# Altium schematic sheet 0191_GPP_A_B_F_G_H.SchDoc
size A2
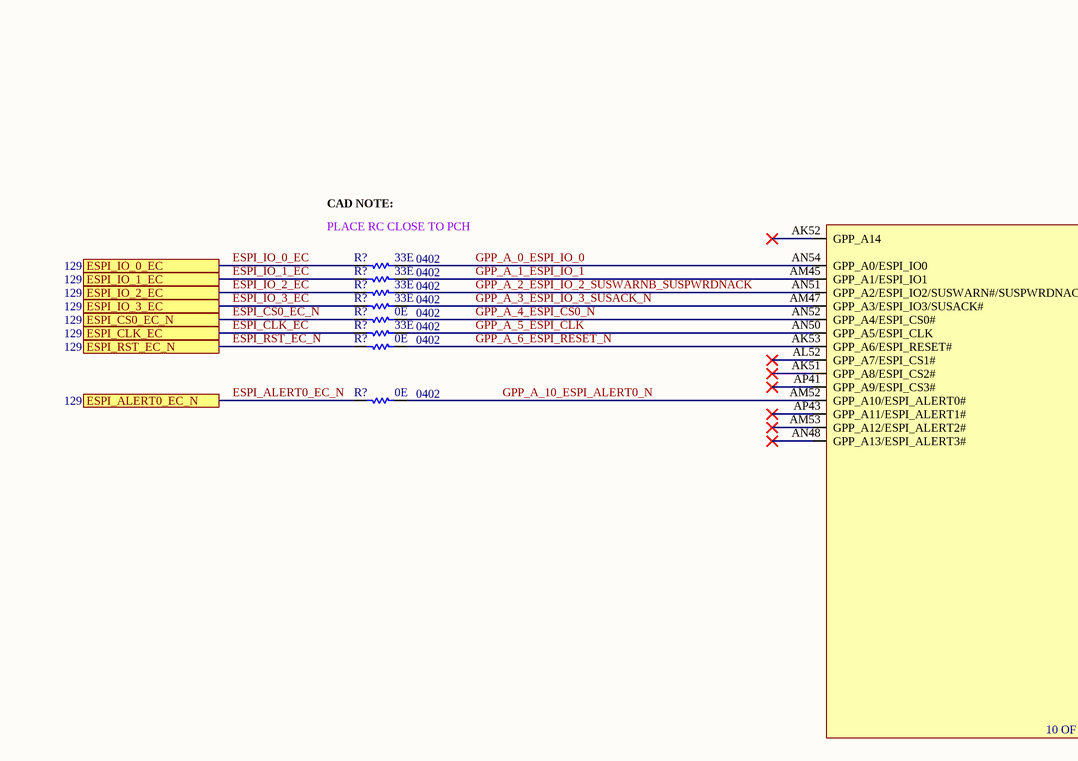
[diagram p0: 0191_GPP_A_B_F_G_H.SchDoc, top left]
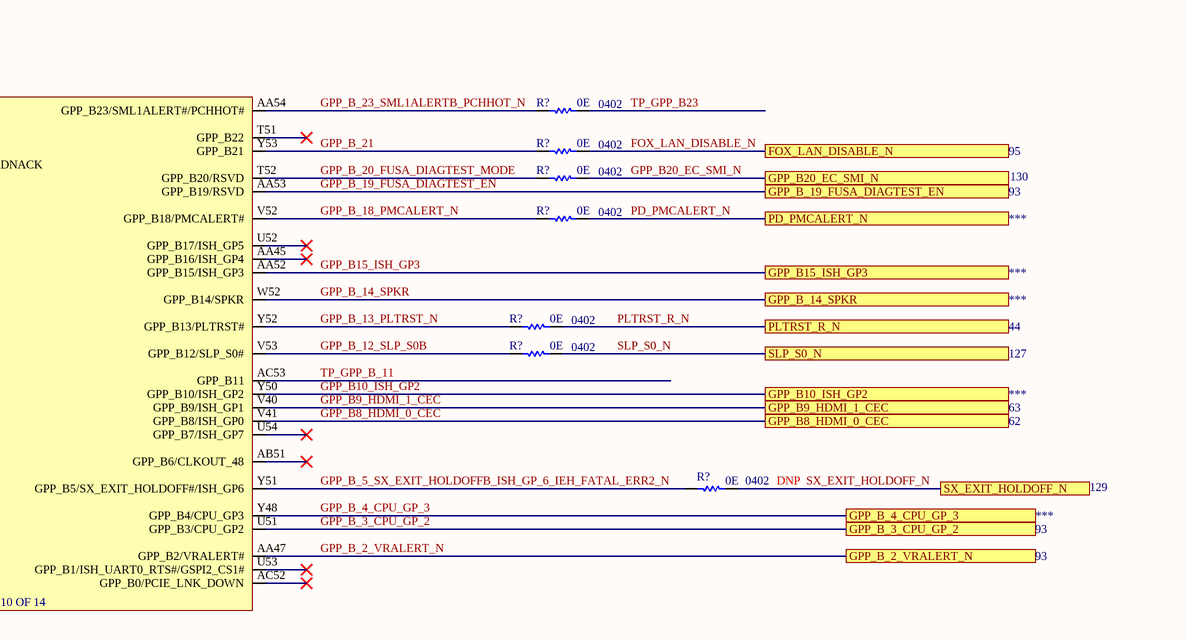
[diagram p1: 0191_GPP_A_B_F_G_H.SchDoc, top middle]
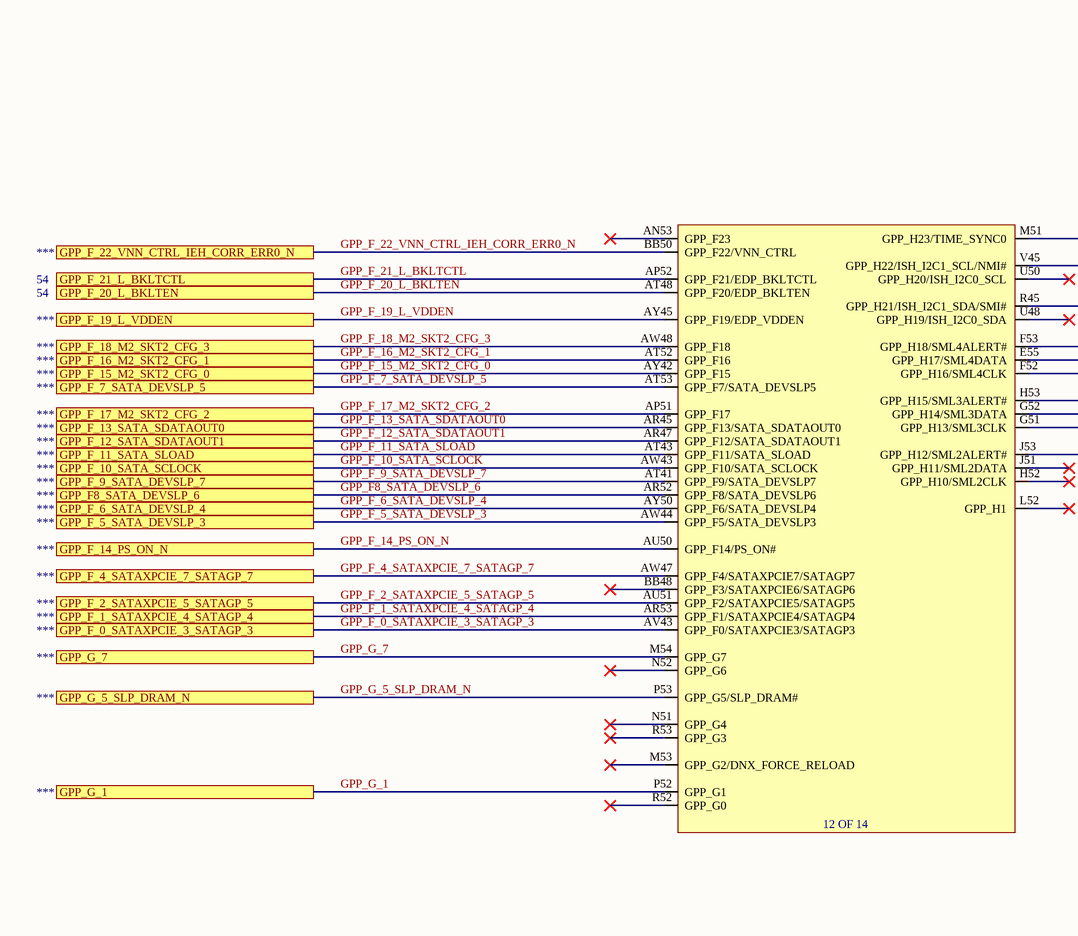
[diagram p2: 0191_GPP_A_B_F_G_H.SchDoc, bottom left]
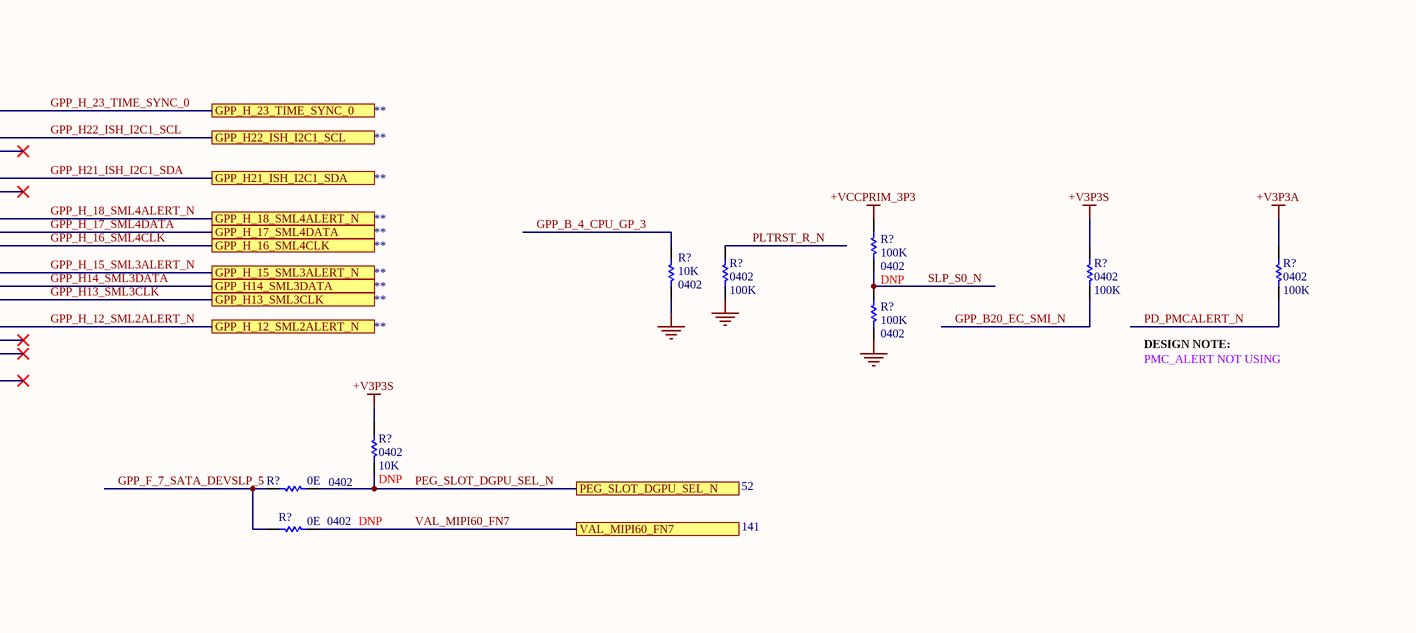
[diagram p3: 0191_GPP_A_B_F_G_H.SchDoc, bottom middle]

## Parts
(Parts that share a designator on the sheet are numbered #1, #2 ... from top to bottom, then left to right.)
R?#1  value 0E  Case/Package: 0402  [RESC0402]  (hidden comment: Res)
R?#2  value 33E  Case/Package: 0402  [RESC0402]  (hidden comment: Res)
R?#3  value 33E  Case/Package: 0402  [RESC0402]  (hidden comment: Res)
R?#4  value 0E  Case/Package: 0402  [RESC0402]  (hidden comment: Res)
R?#5  value 33E  Case/Package: 0402  [RESC0402]  (hidden comment: Res)
R?#6  value 33E  Case/Package: 0402  [RESC0402]  (hidden comment: Res)
R?#7  value 0E  Case/Package: 0402  [RESC0402]  (hidden comment: Res)
R?#8  value 0E  Case/Package: 0402  [RESC0402]  (hidden comment: Res)
R?#9  value 33E  Case/Package: 0402  [RESC0402]  (hidden comment: Res)
R?#10  value 0E  Case/Package: 0402  [RESC0402]  (hidden comment: Res)
R?#11  value 0E  Case/Package: 0402  [RESC0402]  (hidden comment: Res)
R?#12  value 0E  Case/Package: 0402  [RESC0402]  (hidden comment: Res)
R?#13  value 0E  Case/Package: 0402  [RESC0402]  (hidden comment: Res)
R?#14  value 0E  Case/Package: 0402  [RESC0402]  (hidden comment: Res)
R?#15  value 0E  Case/Package: 0402  [RESC0402]  (hidden comment: Res)
R?#16  value 100K  Case/Package: 0402  [RESC0402]  (hidden comment: Res)
R?#17  value 10K  Case/Package: 0402  [RESC0402]  (hidden comment: Res)
R?#18  value 100K  Case/Package: 0402  [RESC0402]  (hidden comment: Res)
R?#19  value 100K  Case/Package: 0402  [RESC0402]  (hidden comment: Res)
R?#20  value 100K  Case/Package: 0402  [RESC0402]  (hidden comment: Res)
R?#21  value 100K  Case/Package: 0402  [RESC0402]  (hidden comment: Res)
R?#22  value 10K  Case/Package: 0402  [RESC0402]  (hidden comment: Res)
R?#23  value 0E  Case/Package: 0402  [RESC0402]  (hidden comment: Res)
R?#24  value 0E  Case/Package: 0402  [RESC0402]  (hidden comment: Res)
U23601  C_RPL_S_PCH_EXT  (value not drawn)  (parts J,L of 14)

## Ports
ESPI_ALERT0_EC_N, ESPI_CLK_EC, ESPI_CS0_EC_N, ESPI_IO_0_EC, ESPI_IO_1_EC, ESPI_IO_2_EC, ESPI_IO_3_EC, ESPI_RST_EC_N, FOX_LAN_DISABLE_N, GPP_B8_HDMI_0_CEC, GPP_B9_HDMI_1_CEC, GPP_B10_ISH_GP2, GPP_B15_ISH_GP3, GPP_B20_EC_SMI_N, GPP_B_2_VRALERT_N, GPP_B_3_CPU_GP_2, GPP_B_4_CPU_GP_3, GPP_B_14_SPKR, GPP_B_19_FUSA_DIAGTEST_EN, GPP_F8_SATA_DEVSLP_6, GPP_F_0_SATAXPCIE_3_SATAGP_3, GPP_F_1_SATAXPCIE_4_SATAGP_4, GPP_F_2_SATAXPCIE_5_SATAGP_5, GPP_F_4_SATAXPCIE_7_SATAGP_7, GPP_F_5_SATA_DEVSLP_3, GPP_F_6_SATA_DEVSLP_4, GPP_F_7_SATA_DEVSLP_5, GPP_F_9_SATA_DEVSLP_7, GPP_F_10_SATA_SCLOCK, GPP_F_11_SATA_SLOAD, GPP_F_12_SATA_SDATAOUT1, GPP_F_13_SATA_SDATAOUT0, GPP_F_14_PS_ON_N, GPP_F_15_M2_SKT2_CFG_0, GPP_F_16_M2_SKT2_CFG_1, GPP_F_17_M2_SKT2_CFG_2, GPP_F_18_M2_SKT2_CFG_3, GPP_F_19_L_VDDEN, GPP_F_20_L_BKLTEN, GPP_F_21_L_BKLTCTL, GPP_F_22_VNN_CTRL_IEH_CORR_ERR0_N, GPP_G_1, GPP_G_5_SLP_DRAM_N, GPP_G_7, GPP_H13_SML3CLK, GPP_H14_SML3DATA, GPP_H21_ISH_I2C1_SDA, GPP_H22_ISH_I2C1_SCL, GPP_H_12_SML2ALERT_N, GPP_H_15_SML3ALERT_N, GPP_H_16_SML4CLK, GPP_H_17_SML4DATA, GPP_H_18_SML4ALERT_N, GPP_H_23_TIME_SYNC_0, PD_PMCALERT_N, PEG_SLOT_DGPU_SEL_N, PLTRST_R_N, SLP_S0_N, SX_EXIT_HOLDOFF_N, VAL_MIPI60_FN7

## Nets
+V3P3A: R?#20.1
+V3P3S: R?#19.1 R?#22.2
+VCCPRIM_3P3: R?#16.2
GND: R?#17.1 R?#18.1 R?#21.1
ESPI_ALERT0_EC_N: R?#12.1 ; port ESPI_ALERT0_EC_N
ESPI_CLK_EC: R?#9.1 ; port ESPI_CLK_EC
ESPI_CS0_EC_N: R?#8.1 ; port ESPI_CS0_EC_N
ESPI_IO_0_EC: R?#2.1 ; port ESPI_IO_0_EC
ESPI_IO_1_EC: R?#3.1 ; port ESPI_IO_1_EC
ESPI_IO_2_EC: R?#5.1 ; port ESPI_IO_2_EC
ESPI_IO_3_EC: R?#6.1 ; port ESPI_IO_3_EC
ESPI_RST_EC_N: R?#10.1 ; port ESPI_RST_EC_N
FOX_LAN_DISABLE_N: R?#4.2 ; port FOX_LAN_DISABLE_N
GPP_A_0_ESPI_IO_0: R?#2.2 U23601.AN54(GPP_A0/ESPI_IO0)
GPP_A_1_ESPI_IO_1: R?#3.2 U23601.AM45(GPP_A1/ESPI_IO1)
GPP_A_2_ESPI_IO_2_SUSWARNB_SUSPWRDNACK: R?#5.2 U23601.AN51(GPP_A2/ESPI_IO2/SUSWARN#/SUSPWRDNACK)
GPP_A_3_ESPI_IO_3_SUSACK_N: R?#6.2 U23601.AM47(GPP_A3/ESPI_IO3/SUSACK#)
GPP_A_4_ESPI_CS0_N: R?#8.2 U23601.AN52(GPP_A4/ESPI_CS0#)
GPP_A_5_ESPI_CLK: R?#9.2 U23601.AN50(GPP_A5/ESPI_CLK)
GPP_A_6_ESPI_RESET_N: R?#10.2 U23601.AK53(GPP_A6/ESPI_RESET#)
GPP_A_10_ESPI_ALERT0_N: R?#12.2 U23601.AM52(GPP_A10/ESPI_ALERT0#)
GPP_B8_HDMI_0_CEC: U23601.V41(GPP_B8/ISH_GP0) ; port GPP_B8_HDMI_0_CEC
GPP_B9_HDMI_1_CEC: U23601.V40(GPP_B9/ISH_GP1) ; port GPP_B9_HDMI_1_CEC
GPP_B10_ISH_GP2: U23601.Y50(GPP_B10/ISH_GP2) ; port GPP_B10_ISH_GP2
GPP_B15_ISH_GP3: U23601.AA52(GPP_B15/ISH_GP3) ; port GPP_B15_ISH_GP3
GPP_B20_EC_SMI_N: R?#7.2 R?#19.2 ; port GPP_B20_EC_SMI_N
GPP_B_2_VRALERT_N: U23601.AA47(GPP_B2/VRALERT#) ; port GPP_B_2_VRALERT_N
GPP_B_3_CPU_GP_2: U23601.U51(GPP_B3/CPU_GP2) ; port GPP_B_3_CPU_GP_2
GPP_B_4_CPU_GP_3: R?#17.2 U23601.Y48(GPP_B4/CPU_GP3) ; port GPP_B_4_CPU_GP_3
GPP_B_5_SX_EXIT_HOLDOFFB_ISH_GP_6_IEH_FATAL_ERR2_N: R?#15.1 U23601.Y51(GPP_B5/SX_EXIT_HOLDOFF#/ISH_GP6)
GPP_B_12_SLP_S0B: R?#14.1 U23601.V53(GPP_B12/SLP_S0#)
GPP_B_13_PLTRST_N: R?#13.1 U23601.Y52(GPP_B13/PLTRST#)
GPP_B_14_SPKR: U23601.W52(GPP_B14/SPKR) ; port GPP_B_14_SPKR
GPP_B_18_PMCALERT_N: R?#11.1 U23601.V52(GPP_B18/PMCALERT#)
GPP_B_19_FUSA_DIAGTEST_EN: U23601.AA53(GPP_B19/RSVD) ; port GPP_B_19_FUSA_DIAGTEST_EN
GPP_B_20_FUSA_DIAGTEST_MODE: R?#7.1 U23601.T52(GPP_B20/RSVD)
GPP_B_21: R?#4.1 U23601.Y53(GPP_B21)
GPP_B_23_SML1ALERTB_PCHHOT_N: R?#1.1 U23601.AA54(GPP_B23/SML1ALERT#/PCHHOT#)
GPP_F8_SATA_DEVSLP_6: U23601.AR52(GPP_F8/SATA_DEVSLP6) ; port GPP_F8_SATA_DEVSLP_6
GPP_F_0_SATAXPCIE_3_SATAGP_3: U23601.AV43(GPP_F0/SATAXPCIE3/SATAGP3) ; port GPP_F_0_SATAXPCIE_3_SATAGP_3
GPP_F_1_SATAXPCIE_4_SATAGP_4: U23601.AR53(GPP_F1/SATAXPCIE4/SATAGP4) ; port GPP_F_1_SATAXPCIE_4_SATAGP_4
GPP_F_2_SATAXPCIE_5_SATAGP_5: U23601.AU51(GPP_F2/SATAXPCIE5/SATAGP5) ; port GPP_F_2_SATAXPCIE_5_SATAGP_5
GPP_F_4_SATAXPCIE_7_SATAGP_7: U23601.AW47(GPP_F4/SATAXPCIE7/SATAGP7) ; port GPP_F_4_SATAXPCIE_7_SATAGP_7
GPP_F_5_SATA_DEVSLP_3: U23601.AW44(GPP_F5/SATA_DEVSLP3) ; port GPP_F_5_SATA_DEVSLP_3
GPP_F_6_SATA_DEVSLP_4: U23601.AY50(GPP_F6/SATA_DEVSLP4) ; port GPP_F_6_SATA_DEVSLP_4
GPP_F_7_SATA_DEVSLP_5: R?#23.1 R?#24.1 U23601.AT53(GPP_F7/SATA_DEVSLP5) ; port GPP_F_7_SATA_DEVSLP_5
GPP_F_9_SATA_DEVSLP_7: U23601.AT41(GPP_F9/SATA_DEVSLP7) ; port GPP_F_9_SATA_DEVSLP_7
GPP_F_10_SATA_SCLOCK: U23601.AW43(GPP_F10/SATA_SCLOCK) ; port GPP_F_10_SATA_SCLOCK
GPP_F_11_SATA_SLOAD: U23601.AT43(GPP_F11/SATA_SLOAD) ; port GPP_F_11_SATA_SLOAD
GPP_F_12_SATA_SDATAOUT1: U23601.AR47(GPP_F12/SATA_SDATAOUT1) ; port GPP_F_12_SATA_SDATAOUT1
GPP_F_13_SATA_SDATAOUT0: U23601.AR45(GPP_F13/SATA_SDATAOUT0) ; port GPP_F_13_SATA_SDATAOUT0
GPP_F_14_PS_ON_N: U23601.AU50(GPP_F14/PS_ON#) ; port GPP_F_14_PS_ON_N
GPP_F_15_M2_SKT2_CFG_0: U23601.AY42(GPP_F15) ; port GPP_F_15_M2_SKT2_CFG_0
GPP_F_16_M2_SKT2_CFG_1: U23601.AT52(GPP_F16) ; port GPP_F_16_M2_SKT2_CFG_1
GPP_F_17_M2_SKT2_CFG_2: U23601.AP51(GPP_F17) ; port GPP_F_17_M2_SKT2_CFG_2
GPP_F_18_M2_SKT2_CFG_3: U23601.AW48(GPP_F18) ; port GPP_F_18_M2_SKT2_CFG_3
GPP_F_19_L_VDDEN: U23601.AY45(GPP_F19/EDP_VDDEN) ; port GPP_F_19_L_VDDEN
GPP_F_20_L_BKLTEN: U23601.AT48(GPP_F20/EDP_BKLTEN) ; port GPP_F_20_L_BKLTEN
GPP_F_21_L_BKLTCTL: U23601.AP52(GPP_F21/EDP_BKLTCTL) ; port GPP_F_21_L_BKLTCTL
GPP_F_22_VNN_CTRL_IEH_CORR_ERR0_N: U23601.BB50(GPP_F22/VNN_CTRL) ; port GPP_F_22_VNN_CTRL_IEH_CORR_ERR0_N
GPP_G_1: U23601.P52(GPP_G1) ; port GPP_G_1
GPP_G_5_SLP_DRAM_N: U23601.P53(GPP_G5/SLP_DRAM#) ; port GPP_G_5_SLP_DRAM_N
GPP_G_7: U23601.M54(GPP_G7) ; port GPP_G_7
GPP_H13_SML3CLK: U23601.G51(GPP_H13/SML3CLK) ; port GPP_H13_SML3CLK
GPP_H14_SML3DATA: U23601.G52(GPP_H14/SML3DATA) ; port GPP_H14_SML3DATA
GPP_H21_ISH_I2C1_SDA: U23601.R45(GPP_H21/ISH_I2C1_SDA/SMI#) ; port GPP_H21_ISH_I2C1_SDA
GPP_H22_ISH_I2C1_SCL: U23601.V45(GPP_H22/ISH_I2C1_SCL/NMI#) ; port GPP_H22_ISH_I2C1_SCL
GPP_H_12_SML2ALERT_N: U23601.J53(GPP_H12/SML2ALERT#) ; port GPP_H_12_SML2ALERT_N
GPP_H_15_SML3ALERT_N: U23601.H53(GPP_H15/SML3ALERT#) ; port GPP_H_15_SML3ALERT_N
GPP_H_16_SML4CLK: U23601.F52(GPP_H16/SML4CLK) ; port GPP_H_16_SML4CLK
GPP_H_17_SML4DATA: U23601.E55(GPP_H17/SML4DATA) ; port GPP_H_17_SML4DATA
GPP_H_18_SML4ALERT_N: U23601.F53(GPP_H18/SML4ALERT#) ; port GPP_H_18_SML4ALERT_N
GPP_H_23_TIME_SYNC_0: U23601.M51(GPP_H23/TIME_SYNC0) ; port GPP_H_23_TIME_SYNC_0
PD_PMCALERT_N: R?#11.2 R?#20.2 ; port PD_PMCALERT_N
PEG_SLOT_DGPU_SEL_N: R?#22.1 R?#23.2 ; port PEG_SLOT_DGPU_SEL_N
PLTRST_R_N: R?#13.2 R?#18.2 ; port PLTRST_R_N
SLP_S0_N: R?#14.2 R?#16.1 R?#21.2 ; port SLP_S0_N
SX_EXIT_HOLDOFF_N: R?#15.2 ; port SX_EXIT_HOLDOFF_N
TP_GPP_B23: R?#1.2
TP_GPP_B_11: U23601.AC53(GPP_B11)
VAL_MIPI60_FN7: R?#24.2 ; port VAL_MIPI60_FN7

Not connected (* = marked no-connect by the designer): U23601 AA45(GPP_B16/ISH_GP4)* AB51(GPP_B6/CLKOUT_48)* AC52(GPP_B0/PCIE_LNK_DOWN)* AK51(GPP_A8/ESPI_CS2#)* AK52(GPP_A14)* AL52(GPP_A7/ESPI_CS1#)* AM53(GPP_A12/ESPI_ALERT2#)* AN48(GPP_A13/ESPI_ALERT3#)* AN53(GPP_F23)* AP41(GPP_A9/ESPI_CS3#)* AP43(GPP_A11/ESPI_ALERT1#)* BB48(GPP_F3/SATAXPCIE6/SATAGP6)* H52(GPP_H10/SML2CLK)* J51(GPP_H11/SML2DATA)* L52(GPP_H1)* M53(GPP_G2/DNX_FORCE_RELOAD)* N51(GPP_G4)* N52(GPP_G6)* R52(GPP_G0)* R53(GPP_G3)* T51(GPP_B22)* U48(GPP_H19/ISH_I2C0_SDA)* U50(GPP_H20/ISH_I2C0_SCL)* U52(GPP_B17/ISH_GP5)* U53(GPP_B1/ISH_UART0_RTS#/GSPI2_CS1#)* U54(GPP_B7/ISH_GP7)*

## Notes on the sheet
- CAD NOTE:
- (near R?#2) PLACE RC CLOSE TO PCH
- DESIGN NOTE:
- PMC_ALERT NOT USING
- (in symbol C_RPL_S_PCH_EXT, part J) 10 OF 14
- (in symbol C_RPL_S_PCH_EXT, part L) 12 OF 14

## Library data of the parts
R?#1 R?#4 R?#7 R?#8 R?#10-R?#15 R?#23 R?#24 = Res: Thick Film Resistor -  0ohm, 1%,0402
  R?#15 R?#24: DNP: DNP
R?#2 R?#3 R?#5 R?#6 R?#9 = Res: Thick Film Resistor -  33ohm, 1%,0402
R?#16 R?#18 R?#21 = Res: Thick Film Resistor -  100Kohm, 1%, 0402
  R?#16: DNP: DNP
R?#17 R?#22 = Res: Thick Film Resistor -  10Kohm, 1%, 0402
  R?#22: DNP: DNP
R?#19 R?#20 = Res: Thick Film Resistor -  100Kohm, 1%,0402
U23601 = C_RPL_S_PCH_EXT: Manufacturer Part Number: *; Case/Package: *